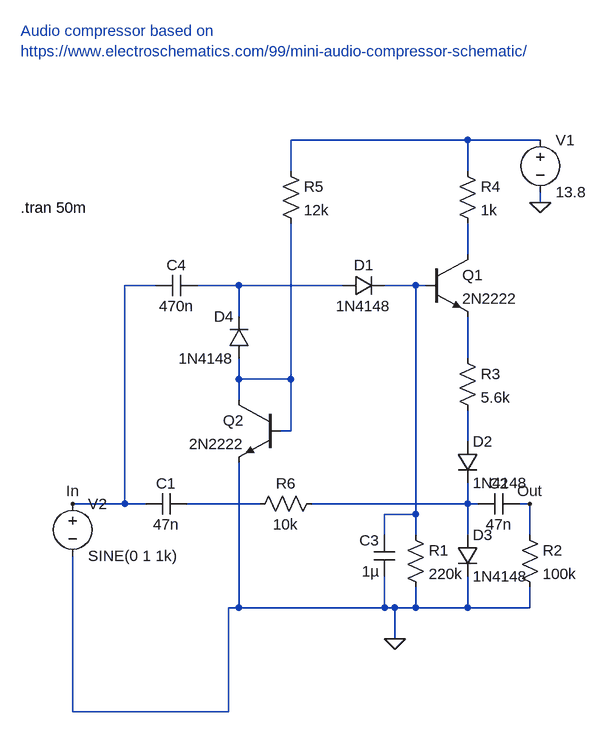
[diagram p0: schematic mini-audio-compressor.asc]
mini-audio-compressor.asc, the LTspice schematic file:
Version 4
SHEET 1 880 748
WIRE 352 -176 80 -176
WIRE 464 -176 352 -176
WIRE 80 -128 80 -176
WIRE 352 -128 352 -176
WIRE 464 -80 464 -96
WIRE 352 0 352 -48
WIRE -128 48 -176 48
WIRE 0 48 -64 48
WIRE 160 48 0 48
WIRE 272 48 224 48
WIRE 288 48 272 48
WIRE 0 96 0 48
WIRE 352 160 352 96
WIRE 0 192 0 160
WIRE 80 192 80 -48
WIRE 80 192 0 192
WIRE 0 224 0 192
WIRE 80 272 80 192
WIRE 80 272 64 272
WIRE 352 288 352 240
WIRE -176 384 -176 48
WIRE -176 384 -256 384
WIRE -144 384 -176 384
WIRE 32 384 -80 384
WIRE 352 384 352 352
WIRE 352 384 112 384
WIRE 368 384 352 384
WIRE 448 384 432 384
WIRE 272 400 272 48
WIRE 272 400 224 400
WIRE 224 432 224 400
WIRE 272 432 272 400
WIRE 352 432 352 384
WIRE 448 432 448 384
WIRE 0 544 0 320
WIRE 0 544 -16 544
WIRE 224 544 224 496
WIRE 224 544 0 544
WIRE 240 544 224 544
WIRE 272 544 272 512
WIRE 272 544 240 544
WIRE 352 544 352 496
WIRE 352 544 272 544
WIRE 448 544 448 512
WIRE 448 544 352 544
WIRE 240 592 240 544
WIRE -256 704 -256 464
WIRE -16 704 -16 544
WIRE -16 704 -256 704
FLAG 464 -80 0
FLAG 240 592 0
FLAG -256 384 In
FLAG 448 384 Out
SYMBOL npn2 288 0 R0
SYMATTR InstName Q1
SYMATTR Value 2N2222
SYMBOL diode 160 64 R270
WINDOW 0 32 32 VTop 2
WINDOW 3 0 32 VBottom 2
SYMATTR InstName D1
SYMATTR Value 1N4148
SYMBOL diode 336 288 R0
SYMATTR InstName D2
SYMATTR Value 1N4148
SYMBOL diode 336 432 R0
SYMATTR InstName D3
SYMATTR Value 1N4148
SYMBOL diode 16 160 R180
WINDOW 0 24 64 Left 2
WINDOW 3 24 0 Left 2
SYMATTR InstName D4
SYMATTR Value 1N4148
SYMBOL npn3 64 224 M0
SYMATTR InstName Q2
SYMATTR Value 2N2222
SYMBOL res 256 416 R0
SYMATTR InstName R1
SYMATTR Value 220k
SYMBOL res 432 416 R0
SYMATTR InstName R2
SYMATTR Value 100k
SYMBOL res 336 144 R0
SYMATTR InstName R3
SYMATTR Value 5.6k
SYMBOL res 336 -144 R0
SYMATTR InstName R4
SYMATTR Value 1k
SYMBOL res 64 -144 R0
SYMATTR InstName R5
SYMATTR Value 12k
SYMBOL res 128 368 R90
WINDOW 0 0 56 VBottom 2
WINDOW 3 32 56 VTop 2
SYMATTR InstName R6
SYMATTR Value 10k
SYMBOL cap -80 368 R90
WINDOW 0 0 32 VBottom 2
WINDOW 3 32 32 VTop 2
SYMATTR InstName C1
SYMATTR Value 47n
SYMBOL cap 432 368 R90
WINDOW 0 0 32 VBottom 2
WINDOW 3 32 32 VTop 2
SYMATTR InstName C2
SYMATTR Value 47n
SYMBOL cap 240 496 R180
WINDOW 0 24 56 Left 2
WINDOW 3 24 8 Left 2
SYMATTR InstName C3
SYMATTR Value 1µ
SYMBOL cap -128 64 R270
WINDOW 0 32 32 VTop 2
WINDOW 3 0 32 VBottom 2
SYMATTR InstName C4
SYMATTR Value 470n
SYMBOL voltage 464 -192 R0
WINDOW 123 0 0 Left 0
WINDOW 39 0 0 Left 0
SYMATTR InstName V1
SYMATTR Value 13.8
SYMBOL voltage -256 368 R0
WINDOW 123 24 124 Left 2
WINDOW 39 0 0 Left 0
SYMATTR InstName V2
SYMATTR Value SINE(0 1 1k)
TEXT -336 -72 Left 2 !.tran 50m
TEXT -336 -344 Left 2 ;Audio compressor based on\nhttps://www.electroschematics.com/99/mini-audio-compressor-schematic/

The netlist it stands for:
* mini-audio-compressor.asc
Q1 N002 N004 N005 0 2N2222
D1 N003 N004 1N4148
D2 N007 N009 1N4148
D3 N009 0 1N4148
D4 N006 N003 1N4148
Q2 N006 N006 0 0 2N2222
R1 N004 0 220k
R2 Out 0 100k
R3 N005 N007 5.6k
R4 N001 N002 1k
R5 N001 N006 12k
R6 N009 N008 10k
C1 N008 In 47n
C2 Out N009 47n
C3 0 N004 1µ
C4 In N003 470n
V1 N001 0 13.8
V2 In 0 SINE(0 1 1k)
.model D D
.lib standard.dio
.model NPN NPN
.model PNP PNP
.lib standard.bjt
.tran 50m
* Audio compressor based on
* https://www.electroschematics.com/99/mini-audio-compressor-schematic/
.backanno
.end